# Altium project PCB_Project_Test_Template.PrjPcb
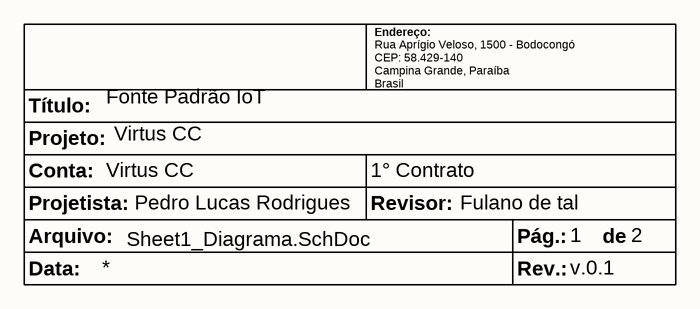
[diagram p0: Sheet1_Diagrama.SchDoc]
Conta: Virtus CC; NumeroContrato: 1° Contrato; Projetista: Pedro Lucas Rodrigues; Projeto: Virtus CC; Rev: v.0.1; Revisor: Fulano de tal; TituloProjeto: Fonte Padrão IoT
2 sheets, 2 parts. Net scope: global (net labels, ports and power ports of the same name join across sheets).
Board file: PCB_IoT_Source.PcbDoc
Sheets:
  Sheet1_Diagrama.SchDoc
  Sheet2_Hierarquia.SchDoc

## Sheet Sheet1_Diagrama.SchDoc
size A4; SheetNumber: 1; SheetTotal: 2

### Parts
(Parts that share a designator on the sheet are numbered #1, #2 ... from top to bottom, then left to right.)
TB?#1  Title Block  (value not drawn)  (graphical)

### Notes on the sheet
- (in symbol Title Block) Type @ to refer to a designator; Endereço:; Título:; Rua Aprígio Veloso, 1500 - Bodocongó / CEP: 58.429-140 / Campina Grande, Paraíba / Brasil; Projeto:; Conta:; Projetista:; Revisor:; Arquivo:; Pág.:; de; Data:; Rev.:

## Sheet Sheet2_Hierarquia.SchDoc
size A4; SheetNumber: 2; SheetTotal: 3
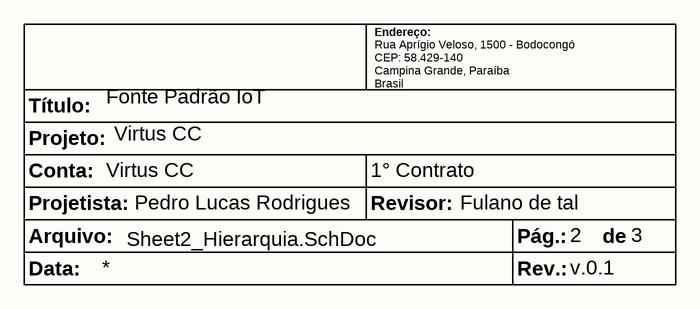
[diagram p1: Sheet2_Hierarquia.SchDoc]

### Parts
(Parts that share a designator on the sheet are numbered #1, #2 ... from top to bottom, then left to right.)
TB?#2  Title Block  (value not drawn)  (graphical)

### Notes on the sheet
- (in symbol Title Block) Type @ to refer to a designator; Endereço:; Título:; Rua Aprígio Veloso, 1500 - Bodocongó / CEP: 58.429-140 / Campina Grande, Paraíba / Brasil; Projeto:; Conta:; Projetista:; Revisor:; Arquivo:; Pág.:; de; Data:; Rev.:

## Assembly variants
Assembly: all parts fitted